# EAGLE board Baseboard (EAGLE 9.6.2)
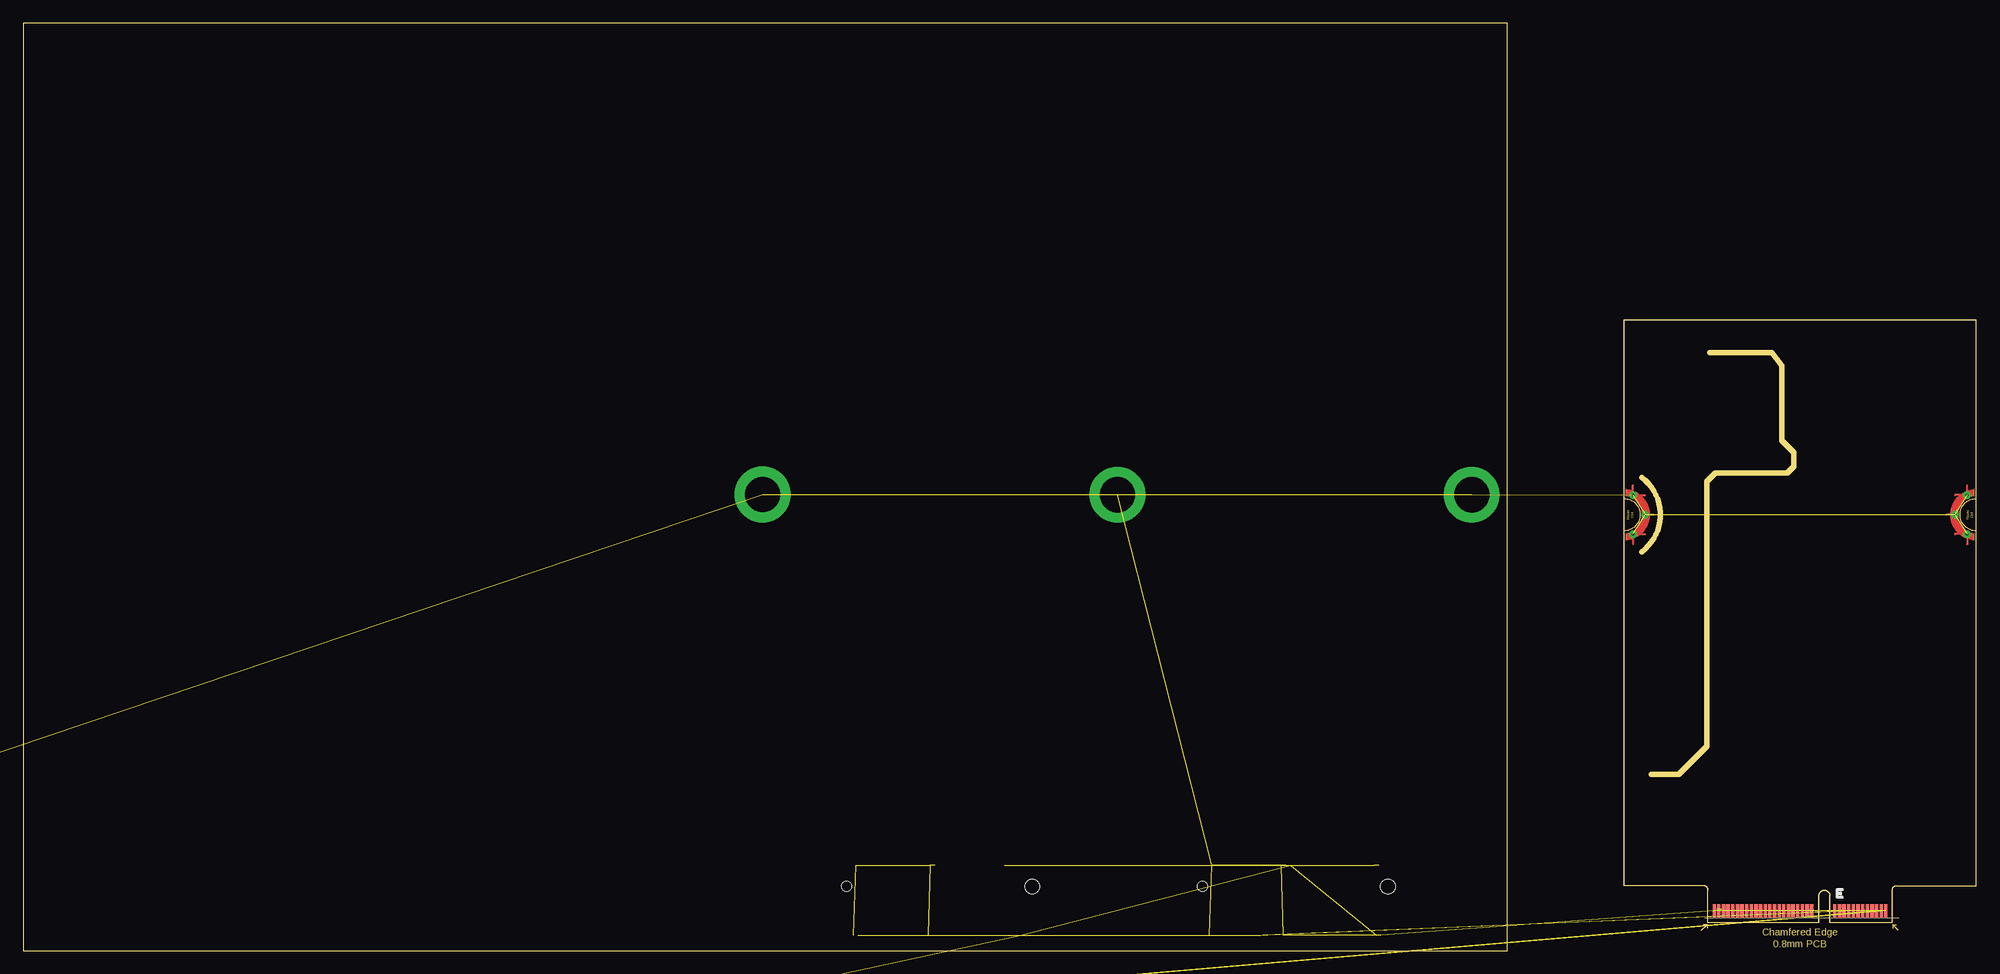
[diagram p15: board, top side]
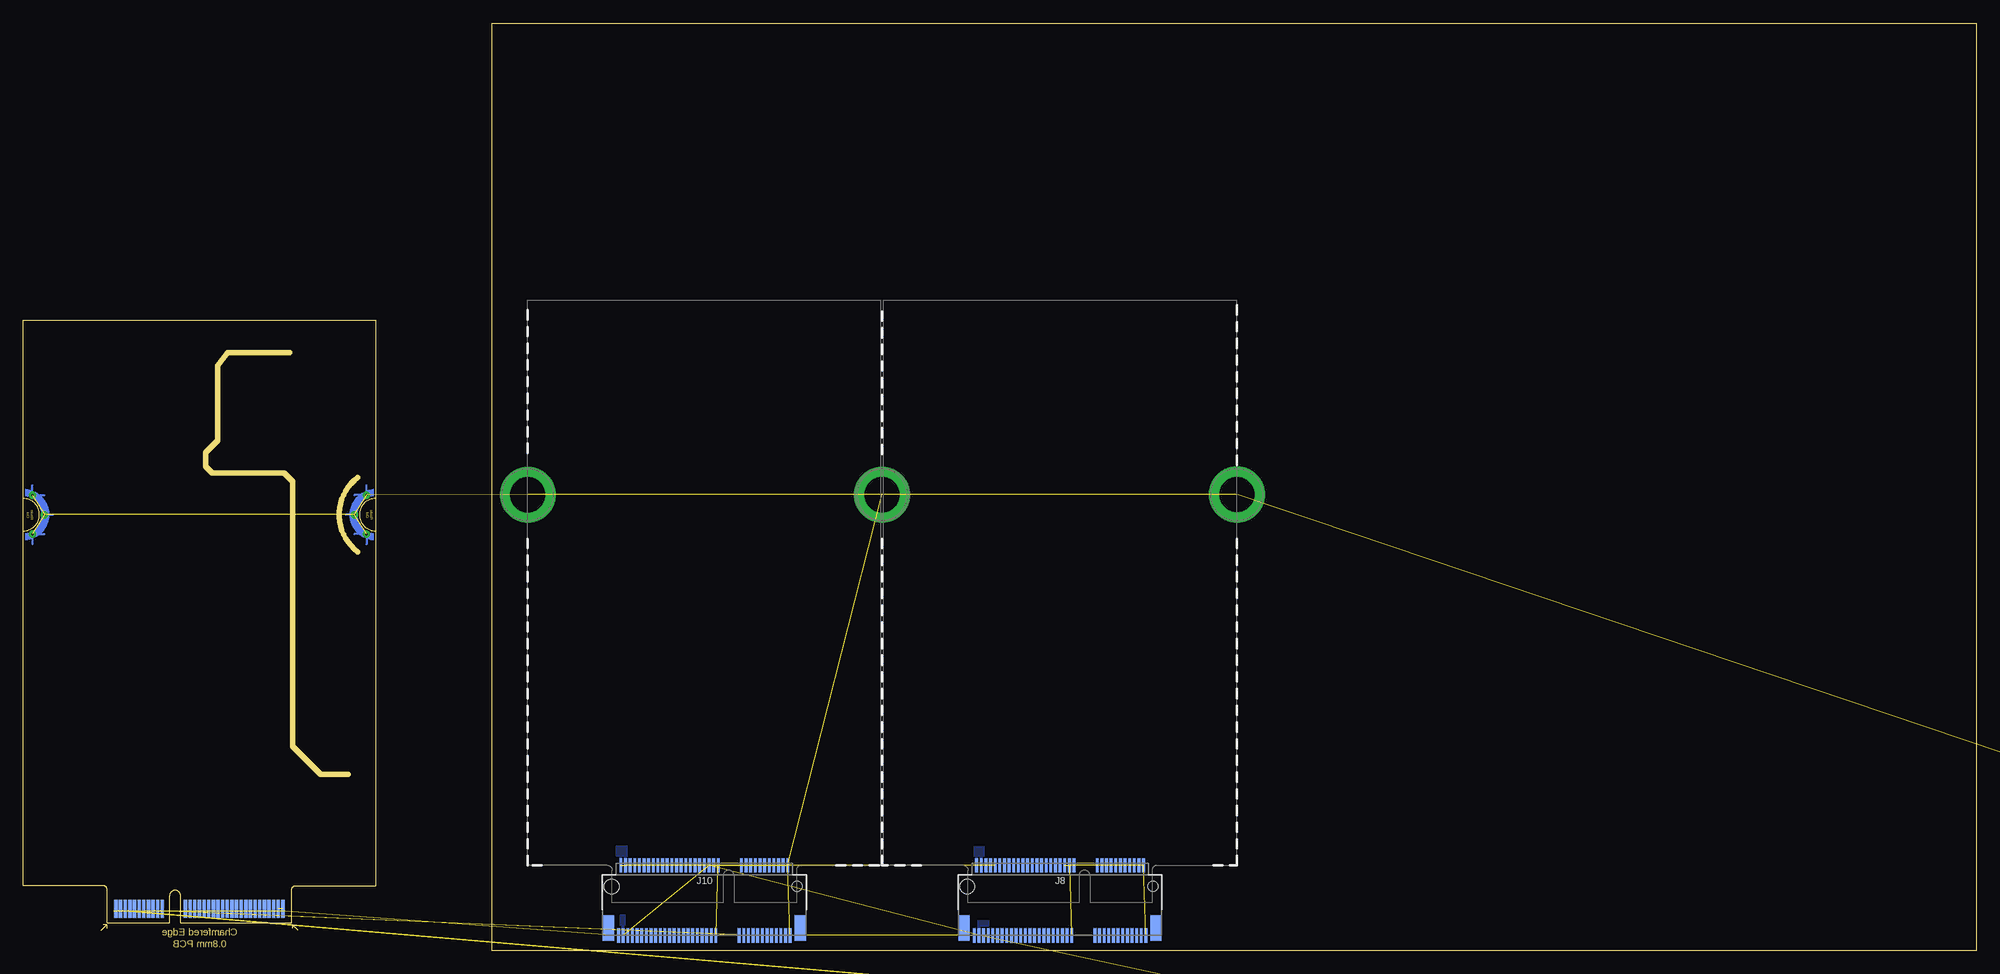
[diagram p16: board, bottom side, seen from below]

Size 210.55 x 100 mm. Coordinates in mm from the lower left corner, seen from the top.
Outline: 0,0 160,0 160,100 0,100 0,0
Outline: 201.47,3 194.78,3 194.78,5.9 arc180 193.57,5.9 193.57,3 181.62,3 181.62,6.5 arc90 181.15,7 172.55,7 172.55,68 210.55,68 210.55,7 201.95,7 arc90 201.47,6.5 201.47,3
Copper layers (1*16): Top 0.035mm / dielectric 1.5mm / Bottom 0.035mm
Design rules "default": minimum track width 6mil, minimum drill 0.35mm, track to track 6mil, track to pad 6mil, pad to pad 6mil, via to via 6mil, smd to smd 6mil, copper to edge 40mil, drill to drill 6mil, minimum pad ring 10mil, minimum via ring 8mil, stop-mask expansion 4mil, vias tented up to drill 0mil, thermal gap 10mil
Net classes: 0 default: width 0 mm, drill 0 mm; 1 POWER: width 0.559 mm, drill 0.305 mm; 2 Diff pairs: width 0.203 mm, drill 0.305 mm
bRestrict: area 135.8,9 to 135.9,9.4; area 135.3,9 to 135.4,9.4; area 98,9 to 98.1,9.4; area 97.4,9 to 97.6,9.4; area 65,25.9 to 65.1,26.1
Milling: 12 lines

## Footprints (pad centres in the part's own frame; a part is rotated, then mirrored left to right if it is on the bottom)
WJ212R-THR-3.5-2 = drill 1 square: 1A 5.6,10.6; 1B 5.6,3.6; 2A 2.1,10.6; 2B 2.1,3.6
DISCRETE_C0603 = smd 0.889 x 0.889: 1 -0.762,0; 2 0.762,0
PANASONIC_E = smd 3.8 x 1.4: + 3,0; - -3,0
DISCRETE_C1206 = smd 1.27 x 2.032: 1 -1.651,0; 2 1.651,0
0805-NO = smd 1.24 x 1.5: 1 -0.95,0; 2 0.95,0
C1206 = smd 1.27 x 2.032: 1 -1.651,0; 2 1.651,0
PANASONIC_D = smd 3 x 1.4: + 2.4,0; - -2.4,0
0603-CAP = smd 1.1 x 1: 1 -0.85,0; 2 0.85,0
C0603 = smd 1.1 x 1: 1 -0.85,0; 2 0.85,0
C1206' = smd 1.6 x 1.8: 1 -1.4,0; 2 1.4,0
0603 = smd 1.1 x 1: 1 -0.85,0; 2 0.85,0
1206 = smd 1.6 x 1.8: 1 -1.4,0; 2 1.4,0
C0402 = smd 0.7 x 0.9: 1 -0.65,0; 2 0.65,0
SOT363 = smd 0.5 x 0.5: 1 -0.75,-0.9; 3 0.75,-0.9; 4 0.75,0.9; 6 -0.75,0.9 | smd 0.4 x 0.5: 2 0,-0.9; 5 0,0.9
CHIP-LED0603 = smd 0.8 x 0.8: A 0,-0.75; C 0,0.75
DO-214AC = smd 1.8 x 2.4: A 2.025,0; C -2.025,0
SOD87 = smd 1.45 x 2.6: 1 -2.445,0; 2 2.445,0
SOT23 = smd 1 x 1.4: 1 -0.95,-1.1; 2 0.95,-1.1; 3 0,1.1
SMB = smd 2.4 x 2.4: A 2.2,0; C -2.2,0
SOT-23-6 = smd 0.55 x 1.35: 1 -0.95,-1.375; 2 0,-1.375; 3 0.95,-1.375; 4 0.95,1.375; 5 0,1.375; 6 -0.95,1.375
SOD123FL = smd 0.91 x 1.22: A 1.625,0; C -1.625,0
SOD-323 = smd 0.63 x 0.83: A 1.15,0; C -1.15,0
WJ212R-THR-3.5-3 = drill 1 square: 1A 9.1,10.6; 1B 9.1,3.6; 2A 5.6,10.6; 2B 5.6,3.6; 3A 2.1,10.6; 3B 2.1,3.6
1206L = smd 1 x 1.8: 1 -1.4,0; 2 1.4,0
STAND-OFF-REFLOW-M2.5 = drill 3.8 pad 6: 1 0,0
SO08 = smd 0.66 x 2.032: 1 -1.905,-3.073; 2 -0.635,-3.073; 3 0.635,-3.073; 4 1.905,-3.073; 5 1.905,3.073; 6 0.635,3.073; 7 -0.635,3.073; 8 -1.905,3.073
CH376S-SOIC = smd 2.052 x 0.602: A0 -4.654,-0.635; ACT# 4.654,3.175; BZ/D4 4.654,-3.175; D0 4.654,-8.255; D1 4.654,-6.985; D2 4.654,-5.715; GND -4.654,-5.715; INT# -4.654,8.255; NC -4.654,0.635; PCS# 4.654,6.985; RD# -4.654,4.445; RSTI -4.654,6.985; RXD -4.654,1.905; SCK/D5 4.654,-1.905; SCS/D3 4.654,-4.445; SD-CK 4.654,5.715; SD-CS 4.654,1.905; SD-DO 4.654,4.445; SDI/D6 4.654,-0.635; SDO/D7 4.654,0.635; TXD -4.654,3.175; UD+ -4.654,-3.175; UD- -4.654,-4.445; V3 -4.654,-1.905; VCC 4.654,8.255; WR# -4.654,5.715; XI -4.654,-6.985; XO -4.654,-8.255
TO263-5 = smd 1.067 x 2.159: 1 -3.404,-5.791; 2 -1.702,-5.791; 3 0,-5.791; 4 1.702,-5.791; 5 3.404,-5.791 | smd 10.8 x 10.41: 6 0,2.54
SOT223 = smd 1.5 x 2: 1 -2.3,-3.15; 2 0,-3.15; 3 2.3,-3.15 | smd 3.8 x 2: 4 0,3.15
SO16W = smd 0.6 x 2.2: 1 -4.445,-4.6; 2 -3.175,-4.6; 3 -1.905,-4.6; 4 -0.635,-4.6; 5 0.635,-4.6; 6 1.905,-4.6; 7 3.175,-4.6; 8 4.445,-4.6; 9 4.445,4.6; 10 3.175,4.6; 11 1.905,4.6; 12 0.635,4.6; 13 -0.635,4.6; 14 -1.905,4.6; 15 -3.175,4.6; 16 -4.445,4.6
SULLINS_SBH11-PBPC-D05-ST-BK = drill 1 square: 1 -5.08,-1.27 | drill 1: 2 -5.08,1.27; 3 -2.54,-1.27; 4 -2.54,1.27; 5 0,-1.27; 6 0,1.27; 7 2.54,-1.27; 8 2.54,1.27; 9 5.08,-1.27; 10 5.08,1.27
MAGJACK-SYM_LED = drill 0.9 pad 1.5: 1 -5.715,8.89; 2 -4.445,6.35; 3 -3.175,8.89; 4 -1.905,6.35; 5 -0.635,8.89; 6 0.635,6.35; 7 1.905,8.89; 8 3.175,6.35; 9 4.445,8.89; 10 5.715,6.35; 11 -6.63,-4.06; 12 -4.09,-4.06; 13 4.09,-4.06; 14 6.63,-4.06 | drill 1.7 pad 2.4: S1 -7.875,3.05; S2 7.875,3.05 | hole 3.25: -5.715,0; 5.715,0
SEEED_110990030 = drill 0.8 square: 1 -3,0 | drill 0.8: 2 -1,0; 3 1,0; 4 3,0
M.2-CONNECTOR-E-FUNCTION-STANDARD = smd 0.3 x 1.55: 1 9.25,-5.275; 2 9,2.275; 3 8.75,-5.275; 4 8.5,2.275; 5 8.25,-5.275; 6 8,2.275; 7 7.75,-5.275; 8 7.5,2.275; 9 7.25,-5.275; 10 7,2.275; 11 6.75,-5.275; 12 6.5,2.275; 13 6.25,-5.275; 14 6,2.275; 15 5.75,-5.275; 16 5.5,2.275; 17 5.25,-5.275; 18 5,2.275; 19 4.75,-5.275; 20 4.5,2.275; 21 4.25,-5.275; 22 4,2.275; 23 3.75,-5.275; 32 1.5,2.275; 33 1.25,-5.275; 34 1,2.275; 35 0.75,-5.275; 36 0.5,2.275; 37 0.25,-5.275; 38 0,2.275; 39 -0.25,-5.275; 40 -0.5,2.275; 41 -0.75,-5.275; 42 -1,2.275; 43 -1.25,-5.275; 44 -1.5,2.275; 45 -1.75,-5.275; 46 -2,2.275; 47 -2.25,-5.275; 48 -2.5,2.275; 49 -2.75,-5.275; 50 -3,2.275; 51 -3.25,-5.275; 52 -3.5,2.275; 53 -3.75,-5.275; 54 -4,2.275; 55 -4.25,-5.275; 56 -4.5,2.275; 57 -4.75,-5.275; 58 -5,2.275; 59 -5.25,-5.275; 60 -5.5,2.275; 61 -5.75,-5.275; 62 -6,2.275; 63 -6.25,-5.275; 64 -6.5,2.275; 65 -6.75,-5.275; 66 -7,2.275; 67 -7.25,-5.275; 68 -7.5,2.275; 69 -7.75,-5.275; 70 -8,2.275; 71 -8.25,-5.275; 72 -8.5,2.275; 73 -8.75,-5.275; 74 -9,2.275; 75 -9.25,-5.275 | smd 1.2 x 2.75: A1 10.35,-4.5; A2 -10.35,-4.5 | hole 1.1: 10,0 | hole 1.6: -10,0
1X2-3.5MM = drill 1 pad 2.184: 1 1.8,0; 2 -1.7,0
M.2-CARD-E-22_FUNCTION_STANDARD = smd 0.35 x 1.45: 1 9.25,1.275; 3 8.75,1.275; 5 8.25,1.275; 7 7.75,1.275; 9 7.25,1.275; 11 6.75,1.275; 13 6.25,1.275; 15 5.75,1.275; 17 5.25,1.275; 19 4.75,1.275; 21 4.25,1.275; 23 3.75,1.275; 33 1.25,1.275; 35 0.75,1.275; 37 0.25,1.275; 39 -0.25,1.275; 41 -0.75,1.275; 43 -1.25,1.275; 45 -1.75,1.275; 47 -2.25,1.275; 49 -2.75,1.275; 51 -3.25,1.275; 53 -3.75,1.275; 55 -4.25,1.275; 57 -4.75,1.275; 59 -5.25,1.275; 61 -5.75,1.275; 63 -6.25,1.275; 65 -6.75,1.275; 67 -7.25,1.275; 69 -7.75,1.275; 71 -8.25,1.275; 73 -8.75,1.275; 75 -9.25,1.275 | smd 0.35 x 1.95 bottom: 2 9,1.525; 4 8.5,1.525; 6 8,1.525; 8 7.5,1.525; 10 7,1.525; 12 6.5,1.525; 14 6,1.525; 16 5.5,1.525; 18 5,1.525; 20 4.5,1.525; 22 4,1.525; 32 1.5,1.525; 34 1,1.525; 36 0.5,1.525; 38 0,1.525; 40 -0.5,1.525; 42 -1,1.525; 44 -1.5,1.525; 46 -2,1.525; 48 -2.5,1.525; 50 -3,1.525; 52 -3.5,1.525; 54 -4,1.525; 56 -4.5,1.525; 58 -5,1.525; 60 -5.5,1.525; 62 -6,1.525; 64 -6.5,1.525; 66 -7,1.525; 68 -7.5,1.525; 70 -8,1.525; 72 -8.5,1.525; 74 -9,1.525 | drill 0.305 pad 0.61: GND1 -18,41.9; GND2 -16.7,44; GND3 -18,46.1; GND4 18,41.9; GND5 16.7,44; GND6 18,46.1
FB805 = smd 1.3 x 1.5: 1 -0.85,0; 2 0.85,0
DR127 = smd 3.85 x 5.5: 1 -4.975,0; 2 4.975,0
DP_DEVICES_SW_TACT_STANDARD_RIGHT_ANGLE = drill 1: 1 -2.25,0; 2 2.25,0 | drill 1.5: 3 -3.5,2.5; 4 3.5,2.5
WJ212R-THR-3.5-4 = drill 1 square: 1A 12.6,10.6; 1B 12.6,3.6; 2A 9.1,10.6; 2B 9.1,3.6; 3A 5.6,10.6; 3B 5.6,3.6; 4A 2.1,10.6; 4B 2.1,3.6
SOT-23 = smd 0.802 x 0.972: P1 -0.95,-0.917; P2 0.95,-0.917; P3 0,0.917
SOT23-BEC = smd 1 x 1.4: B -0.95,-1.1; C 0,1.1; E 0.95,-1.1
R0603 = smd 1 x 1.1: 1 -0.85,0; 2 0.85,0
0603@1 = smd 1.1 x 1: 1 -0.85,0; 2 0.85,0
DISCRETE_R0603 = smd 0.889 x 0.889: 1 -0.762,0; 2 0.762,0
R0603' = smd 0.889 x 0.889: 1 -0.762,0; 2 0.762,0
R2512 = smd 1.8 x 3.2: 1 -2.8,0; 2 2.8,0
R0204/5 = drill 0.813 octagon: 1 -2.54,0; 2 2.54,0
R0402 = smd 0.6 x 0.7: 1 -0.5,0; 2 0.5,0
CTS-219-06 = smd 1.13 x 2.44: 1 -6.35,-4.3; 2 -3.81,-4.3; 3 -1.27,-4.3; 4 1.27,-4.3; 5 3.81,-4.3; 6 6.35,-4.3; 7 6.35,4.3; 8 3.81,4.3; 9 1.27,4.3; 10 -1.27,4.3; 11 -3.81,4.3; 12 -6.35,4.3
9P-SMD-W/-RING = smd 1.524 x 0.762: 1 0,4.4; 2 0,3.3; 3 0,2.2; 4 0,1.1; 5 0,0; 6 0,-1.1; 7 0,-2.2; 8 0,-3.3; 9 0,-4.4 | smd 1.524 x 1.016: G1 0.6,-5.746 | smd 2.032 x 1.524: G2 10.373,-5.4; G3 10.373,10 | smd 1.524 x 1.524: G4 0.392,9.181 | hole 0.889: 10.9,-2.6; 10.9,5.4
SJ = smd 1.168 x 1.6: 1 -0.762,0; 2 0.762,0
QFN20_4MM_0.65MM = smd 0.35 x 0.95: 1 -1.3,-2.34; 2 -0.65,-2.34; 3 0,-2.34; 4 0.65,-2.34; 5 1.3,-2.34; 11 1.3,2.34; 12 0.65,2.34; 13 0,2.34; 14 -0.65,2.34; 15 -1.3,2.34 | smd 0.95 x 0.35: 6 2.34,-1.3; 7 2.34,-0.65; 8 2.34,0; 9 2.34,0.65; 10 2.34,1.3; 16 -2.34,1.3; 17 -2.34,0.65; 18 -2.34,0; 19 -2.34,-0.65; 20 -2.34,-1.3 | smd 3.25 x 3.25: PAD 0,0
LED_WS2812-2020 = smd 0.7 x 0.7: 1 0.915,-0.55; 2 0.915,0.55; 3 -0.915,0.55; 4 -0.915,-0.55
XCVR_ESP32S3WROOM1N8R8 = smd 1.5 x 0.9: 1 -8.75,5.26; 2 -8.75,3.99; 3 -8.75,2.72; 4 -8.75,1.45; 5 -8.75,0.18; 6 -8.75,-1.09; 7 -8.75,-2.36; 8 -8.75,-3.63; 9 -8.75,-4.9; 10 -8.75,-6.17; 11 -8.75,-7.44; 12 -8.75,-8.71; 13 -8.75,-9.98; 14 -8.75,-11.25; 27 8.75,-11.25; 28 8.75,-9.98; 29 8.75,-8.71; 30 8.75,-7.44; 31 8.75,-6.17; 32 8.75,-4.9; 33 8.75,-3.63; 34 8.75,-2.36; 35 8.75,-1.09; 36 8.75,0.18; 37 8.75,1.45; 38 8.75,2.72; 39 8.75,3.99; 40 8.75,5.26 | smd 0.9 x 1.5: 15 -6.985,-12.5; 16 -5.715,-12.5; 17 -4.445,-12.5; 18 -3.175,-12.5; 19 -1.905,-12.5; 20 -0.635,-12.5; 21 0.635,-12.5; 22 1.905,-12.5; 23 3.175,-12.5; 24 4.445,-12.5; 25 5.715,-12.5; 26 6.985,-12.5 | smd 0.9 x 0.9: 41_1 -1.5,-2.46; 41_2 -2.9,-2.46; 41_3 -0.1,-2.46; 41_4 -2.9,-3.86; 41_5 -1.5,-3.86; 41_6 -0.1,-3.86; 41_7 -2.9,-1.06; 41_8 -1.5,-1.06; 41_9 -0.1,-1.06
MSOP10 = smd 0.25 x 1: 1 -1,-2.113; 2 -0.5,-2.113; 3 0,-2.113; 4 0.5,-2.113; 5 1,-2.113; 6 1,2.113; 7 0.5,2.113; 8 0,2.113; 9 -0.5,2.113; 10 -1,2.113
LQFP-48 = smd 0.254 x 1.143: 1 -2.75,-4.25; 2 -2.25,-4.25; 3 -1.75,-4.25; 4 -1.25,-4.25; 5 -0.75,-4.25; 6 -0.25,-4.25; 7 0.25,-4.25; 8 0.75,-4.25; 9 1.25,-4.25; 10 1.75,-4.25; 11 2.25,-4.25; 12 2.75,-4.25; 25 2.75,4.25; 26 2.25,4.25; 27 1.75,4.25; 28 1.25,4.25; 29 0.75,4.25; 30 0.25,4.25; 31 -0.25,4.25; 32 -0.75,4.25; 33 -1.25,4.25; 34 -1.75,4.25; 35 -2.25,4.25; 36 -2.75,4.25 | smd 1.143 x 0.254: 13 4.25,-2.75; 14 4.25,-2.25; 15 4.25,-1.75; 16 4.25,-1.25; 17 4.25,-0.75; 18 4.25,-0.25; 19 4.25,0.25; 20 4.25,0.75; 21 4.25,1.25; 22 4.25,1.75; 23 4.25,2.25; 24 4.25,2.75; 37 -4.25,2.75; 38 -4.25,2.25; 39 -4.25,1.75; 40 -4.25,1.25; 41 -4.25,0.75; 42 -4.25,0.25; 43 -4.25,-0.25; 44 -4.25,-0.75; 45 -4.25,-1.25; 46 -4.25,-1.75; 47 -4.25,-2.25; 48 -4.25,-2.75
OPTO_EL357N-G = smd 1.676 x 0.813: 1 -3.175,1.27; 2 -3.175,-1.27; 3 3.175,-1.27; 4 3.175,1.27
JRC-21F-4100 = drill 1 offset: C1 -4.3,3.8; C2 -4.3,-3.8; COIL+ 5.85,-3.8; COIL- 5.85,3.8; NC 8.4,-3.8; NO 8.4,3.8
USB-C-16P = smd 0.3 x 1.45: A5 -1.25,0; A6 -0.25,0; A7 0.25,0; A8 1.25,0; B5 1.75,0; B6 0.75,0; B7 -0.75,0; B8 -1.75,0 | smd 0.6 x 1.45: GND -3.225,0; GND2 3.225,0 | smd 1 x 2.1: SHLD1 -4.32,-0.915; SHLD2 4.32,-0.915 | smd 1 x 2.1 bottom: SHLD3 -4.32,-0.915; SHLD4 4.32,-0.915 | smd 1 x 1.6: SHLD5 -4.32,-5.095; SHLD8 4.32,-5.095 | smd 1 x 1.6 bottom: SHLD6 -4.32,-5.095; SHLD7 4.32,-5.095 | smd 0.55 x 1.45: VBUS1 -2.45,0; VBUS2 2.45,0 | hole 0.65: -2.89,-1.445; 2.89,-1.445
USB-A-H = drill 0.914: D+ 2.718,-1.003; D- 2.718,1.003; GND 2.718,-3.493; VBUS 2.718,3.493 | drill 2.311: GND@1 0,6.566; GND@2 0,-6.566
B4B-XH = drill 1 square: P$1 3.75,0 | drill 1: P$2 1.25,0; P$3 -1.25,0; P$4 -3.75,0
CRYSTAL_3.2X2.5 = smd 1.4 x 1.2: 1 -1.1,-0.8; 2 1.1,0.8; GND1 -1.1,0.8; GND2 1.1,-0.8
CRYSTAL-SMD-2.0X1.6MM = smd 0.75 x 0.7: 1 -0.675,-0.5; 2 0.675,-0.5; 3 0.675,0.5; 4 -0.675,0.5

## Placement (x,y rotation side)
4-20-1  WJ212R-THR-3.5-2  [WJ212R-THR-3.5-2]  -252.5,-872.5 0 top  (outside the outline)
4-20-2  WJ212R-THR-3.5-2  [WJ212R-THR-3.5-2]  -243.5,-872.5 0 top  (outside the outline)
4-20-3  WJ212R-THR-3.5-2  [WJ212R-THR-3.5-2]  -234.5,-872.5 0 top  (outside the outline)
4-20-4  WJ212R-THR-3.5-2  [WJ212R-THR-3.5-2]  -252.5,-887 0 top  (outside the outline)
ADC1  WJ212R-THR-3.5-2  [WJ212R-THR-3.5-2]  -252.5,-827 0 top  (outside the outline)
ADC2  WJ212R-THR-3.5-2  [WJ212R-THR-3.5-2]  -243.5,-827 0 top  (outside the outline)
ADC3  WJ212R-THR-3.5-2  [WJ212R-THR-3.5-2]  -234.5,-827 0 top  (outside the outline)
ADC4  WJ212R-THR-3.5-2  [WJ212R-THR-3.5-2]  -225.5,-827 0 top  (outside the outline)
C1  0.01uF  [DISCRETE_C0603]  -239,-926 0 top  (outside the outline)
C2  0.1uF  [DISCRETE_C0603]  -243.5,-992.5 0 top  (outside the outline)
C3  220µF 50V  [PANASONIC_E]  -19.05,45.72 0 top  (outside the outline)
C4  10uF  [DISCRETE_C1206]  -250.5,-988.5 0 top  (outside the outline)
C5  220µF 50V  [PANASONIC_E]  -30.48,45.72 0 top  (outside the outline)
C6  0.1uF  [0805-NO]  -251.5,-966 0 top  (outside the outline)
C7  10uF  [C1206]  -250.5,-921 0 top  (outside the outline)
C8  0.1uF  [DISCRETE_C0603]  -30.48,77.47 0 top  (outside the outline)
C9  0.1uF  [0805-NO]  -246,-966 0 top  (outside the outline)
C10  100nF  [0805-NO]  -236,-955.5 0 top  (outside the outline)
C11  10uF  [C1206]  -245,-921 0 top  (outside the outline)
C12  10uF  [0805-NO]  -251.5,-963.5 0 top  (outside the outline)
C13  10uF  [C1206]  -250.5,-842 0 top  (outside the outline)
C14  0.1uF  [DISCRETE_C0603]  -34.29,77.47 0 top  (outside the outline)
C15  0.1uF  [DISCRETE_C0603]  -38.1,77.47 0 top  (outside the outline)
C16  10uF  [C1206]  -57.15,62.23 0 top  (outside the outline)
C17  100uF  [PANASONIC_D]  -71.12,53.34 0 top  (outside the outline)
C18  0.1uF  [0603-CAP]  -57.15,78.74 0 top  (outside the outline)
C19  10uF  [C1206]  -62.23,62.23 0 top  (outside the outline)
C20  0.1uF  [DISCRETE_C0603]  -41.91,77.47 0 top  (outside the outline)
C21  0.1uF  [DISCRETE_C0603]  -45.72,77.47 0 top  (outside the outline)
C22  10uF  [C1206]  -67.31,62.23 0 top  (outside the outline)
C23  1uF  [C1206]  -245,-842 0 top  (outside the outline)
C24  0.1uF  [0805-NO]  -234.5,-857 0 top  (outside the outline)
C25  10uF  [C1206]  -234.5,-899.5 0 top  (outside the outline)
C26  1uF  [C1206]  -229,-899.5 0 top  (outside the outline)
C27  0.1uF  [0805-NO]  -231.5,-904 0 top  (outside the outline)
C28  22P  [C0603]  -227,-1026.5 0 top  (outside the outline)
C29  22P  [C0603]  -252,-1031.5 0 top  (outside the outline)
C30  0.1uF  [C0603]  -245,-1026.5 0 top  (outside the outline)
C31  0.1uF  [C0603]  -239,-1026.5 0 top  (outside the outline)
C32  10uF  [C1206']  -251,-1020.5 0 top  (outside the outline)
C33  0.47uF  [C0603]  -252,-1026.5 0 top  (outside the outline)
C34  0.1uF  [C0603]  -233,-1026.5 0 top  (outside the outline)
C35  10uF  [C1206']  -245,-1020.5 0 top  (outside the outline)
C36  220µF 50V  [PANASONIC_E]  -233.5,-774.5 0 top  (outside the outline)
C37  220µF 50V  [PANASONIC_E]  -248,-788 0 top  (outside the outline)
C38  0.1uF  [0603]  -167.5,-25.5 180 top  (outside the outline)
C39  10pF  [0603]  -178,-22.5 270 top  (outside the outline)
C40  10pF  [0603]  -171,-22.5 90 top  (outside the outline)
C41  10uF  [0603]  -167.5,-22.5 180 top  (outside the outline)
C42  0.1uF  [0603]  -178.5,-15.5 270 top  (outside the outline)
C43  0.1uF  [0603]  -176.5,-15.5 270 top  (outside the outline)
C44  0.1uF  [0603]  -174.5,-15.5 270 top  (outside the outline)
C45  0.1uF  [0603]  -171.5,-41 270 top  (outside the outline)
C46  0.1uF  [0603]  -164.5,-37 0 top  (outside the outline)
C47  0.1uF  [0603]  -169.5,-41 270 top  (outside the outline)
C48  10uF  [0603]  -168.5,-15.5 270 top  (outside the outline)
C49  10nF  [0603]  -164.5,-31 0 top  (outside the outline)
C50  4.7uF  [0603]  -164.5,-33 0 top  (outside the outline)
C51  1nF  [1206]  -171.5,-58 0 top  (outside the outline)
C52  10nF  [0603]  -170.5,-48 90 top  (outside the outline)
C53  6.8nF  [0603]  -173.5,-48 270 top  (outside the outline)
C54  6.8nF  [0603]  -169,-48 270 top  (outside the outline)
C55  22nF  [0603]  -181,-48 90 top  (outside the outline)
C107_N0  100nF  [C0402]  -242,180 0 top  (outside the outline)
C107_N1  100nF  [C0402]  -233,180 0 top  (outside the outline)
C107_N2  100nF  [C0402]  -252,188.5 0 top  (outside the outline)
C107_N3  100nF  [C0402]  -243,188.5 0 top  (outside the outline)
C107_N4  100nF  [C0402]  -242,284.5 0 top  (outside the outline)
C107_N5  100nF  [C0402]  -233,284.5 0 top  (outside the outline)
C107_N6  100nF  [C0402]  -252,293 0 top  (outside the outline)
C107_N7  100nF  [C0402]  -243,293 0 top  (outside the outline)
D1  SMF05C  [SOT363]  -240,-991.5 0 top  (outside the outline)
D2_I1  GRN  [CHIP-LED0603]  -251,446.5 0 top  (outside the outline)
D2_I2  GRN  [CHIP-LED0603]  -251,459 0 top  (outside the outline)
D2_I3  GRN  [CHIP-LED0603]  -251,470.5 0 top  (outside the outline)
D2_I4  GRN  [CHIP-LED0603]  -251,482 0 top  (outside the outline)
D2_I5  GRN  [CHIP-LED0603]  -251,493.5 0 top  (outside the outline)
D2_I6  GRN  [CHIP-LED0603]  -251,505 0 top  (outside the outline)
D2_I7  GRN  [CHIP-LED0603]  -251,516.5 0 top  (outside the outline)
D2_I8  GRN  [CHIP-LED0603]  -251,528 0 top  (outside the outline)
D2_M1  GRN  [CHIP-LED0603]  -251,379.5 0 top  (outside the outline)
D2_M2  GRN  [CHIP-LED0603]  -251,337.5 0 top  (outside the outline)
D2_M3  GRN  [CHIP-LED0603]  -251,351.5 0 top  (outside the outline)
D2_M4  GRN  [CHIP-LED0603]  -251,365.5 0 top  (outside the outline)
D2_M5  GRN  [CHIP-LED0603]  -241,408 0 top  (outside the outline)
D2_M6  GRN  [CHIP-LED0603]  -215,393.5 0 top  (outside the outline)
D2_M7  GRN  [CHIP-LED0603]  -251,408 0 top  (outside the outline)
D2_M8  GRN  [CHIP-LED0603]  -246,408 0 top  (outside the outline)
D5  M4  [DO-214AC]  -16.51,54.61 0 top  (outside the outline)
D6  SS34  [SOD87]  -111.5,-264 0 top  (outside the outline)
D7  M4  [DO-214AC]  -22.86,54.61 0 top  (outside the outline)
D8  BAT54S  [SOT23]  -236,-878.5 0 top  (outside the outline)
D9  BAT54S  [SOT23]  -228,-878.5 0 top  (outside the outline)
D10  BAT54S  [SOT23]  -251,-893 0 top  (outside the outline)
D11  BAT54S  [SOT23]  -243,-893 0 top  (outside the outline)
D12  5.1V  [SMB]  -59.69,45.72 0 top  (outside the outline)
D13  SS34  [DO-214AC]  -35.56,54.61 0 top  (outside the outline)
D14  SS34  [DO-214AC]  -41.91,54.61 0 top  (outside the outline)
D15  BAT54S  [SOT23]  -245,-833 0 top  (outside the outline)
D17  BAT54S  [SOT23]  -237,-833 0 top  (outside the outline)
D18  BAT54S  [SOT23]  -229,-833 0 top  (outside the outline)
D19  BAT54S  [SOT23]  -221,-833 0 top  (outside the outline)
D20  SS34  [DO-214AC]  -224.5,-787.5 0 top  (outside the outline)
D21  12.2V  [SMB]  -238.5,-788 0 top  (outside the outline)
D22  SS34  [SOD87]  -231.5,-787.5 0 top  (outside the outline)
D23  M4  [DO-214AC]  -249.5,-796 0 top  (outside the outline)
D24  M4  [DO-214AC]  -243,-796 0 top  (outside the outline)
D25  DT1042-04SO  [SOT-23-6]  -176.5,-58 270 top  (outside the outline)
D30_RL1  B5819W  [SOD123FL]  -240,426.5 0 top  (outside the outline)
D30_RL2  B5819W  [SOD123FL]  -251,-1067 0 top  (outside the outline)
D30_RL3  B5819W  [SOD123FL]  -251,-1072.5 0 top  (outside the outline)
D30_RL4  B5819W  [SOD123FL]  -251,-1078 0 top  (outside the outline)
D30_RL5  B5819W  [SOD123FL]  -251,-1083.5 0 top  (outside the outline)
D30_RL6  B5819W  [SOD123FL]  -233,426.5 0 top  (outside the outline)
D30_RL7  B5819W  [SOD123FL]  -226,426.5 0 top  (outside the outline)
D30_RL8  B5819W  [SOD123FL]  -219,426.5 0 top  (outside the outline)
D39  SS34  [SOD87]  -67.31,45.72 0 top  (outside the outline)
D51  1N4148  [SOD-323]  -236,228.5 0 top  (outside the outline)
DS18B20  WJ212R-THR-3.5-3  [WJ212R-THR-3.5-3]  -252.5,203 0 top  (outside the outline)
F1_RL1  24V 460mA  [1206L]  -251,141 0 top  (outside the outline)
F1_RL2  24V 460mA  [1206L]  -240.5,141 0 top  (outside the outline)
F1_RL3  24V 460mA  [1206L]  -230,141 0 top  (outside the outline)
F1_RL4  24V 460mA  [1206L]  -219.5,141 0 top  (outside the outline)
F1_RL5  24V 460mA  [1206L]  -242.5,419 0 top  (outside the outline)
F1_RL6  24V 460mA  [1206L]  -232,419 0 top  (outside the outline)
F1_RL7  24V 460mA  [1206L]  -221.5,419 0 top  (outside the outline)
F1_RL8  24V 460mA  [1206L]  -251,426.5 0 top  (outside the outline)
FB1  [0805-NO]  -240.5,-966 0 top  (outside the outline)
FB2  470Ω  [0603]  -180.5,-15.5 270 top  (outside the outline)
FRAME12  FRAME-LEDGERNO_FOOTPRINT  [DUMMY]  124.17,-27.63 0 bottom  (outside the outline)
H2  STAND-OFF-REFLOW-M2.5_2.5MM_TALL  [STAND-OFF-REFLOW-M2.5]  117.96,49.15 180 bottom
H3  STAND-OFF-REFLOW-M2.5_2.5MM_TALL  [STAND-OFF-REFLOW-M2.5]  156.16,49.15 90 bottom
H4  STAND-OFF-REFLOW-M2.5_2.5MM_TALL  [STAND-OFF-REFLOW-M2.5]  79.71,49.18 90 bottom
IC1  MAX31855  [SO08]  -248.5,-914 0 top  (outside the outline)
IC2  CH376  [CH376S-SOIC]  -247.5,-1006 0 top  (outside the outline)
IC3  LM2596HV-12  [TO263-5]  -245.5,-763 0 top  (outside the outline)
IC4  LM2596HV-5  [TO263-5]  -66.04,7.62 0 top  (outside the outline)
IC5  AP2114H-3.3TRG1  [SOT223]  -74.93,31.75 0 top  (outside the outline)
IC6  PCF8574T  [SO16W]  -246,238.5 0 top  (outside the outline)
IC7  PCF8574T  [SO16W]  -246,311.5 0 top  (outside the outline)
INPUT1  WJ212R-THR-3.5-2  [WJ212R-THR-3.5-2]  -252.5,156.5 0 top  (outside the outline)
INPUT2  WJ212R-THR-3.5-2  [WJ212R-THR-3.5-2]  -243.5,156.5 0 top  (outside the outline)
INPUT3  WJ212R-THR-3.5-2  [WJ212R-THR-3.5-2]  -234.5,156.5 0 top  (outside the outline)
INPUT4  WJ212R-THR-3.5-2  [WJ212R-THR-3.5-2]  -225.5,156.5 0 top  (outside the outline)
INPUT5  WJ212R-THR-3.5-2  [WJ212R-THR-3.5-2]  -252.5,261 0 top  (outside the outline)
INPUT6  WJ212R-THR-3.5-2  [WJ212R-THR-3.5-2]  -243.5,261 0 top  (outside the outline)
INPUT7  WJ212R-THR-3.5-2  [WJ212R-THR-3.5-2]  -234.5,261 0 top  (outside the outline)
INPUT8  WJ212R-THR-3.5-2  [WJ212R-THR-3.5-2]  -225.5,261 0 top  (outside the outline)
J1  SBH11-PBPC-D05-ST-BK  [SULLINS_SBH11-PBPC-D05-ST-BK]  -102.5,-149.5 0 top  (outside the outline)
J2  MAGJACK-POE  [MAGJACK-SYM_LED]  -174.5,-71 0 top  (outside the outline)
J3  SBH11-PBPC-D05-ST-BK  [SULLINS_SBH11-PBPC-D05-ST-BK]  -102.5,-180.5 0 top  (outside the outline)
J4  SBH11-PBPC-D05-ST-BK  [SULLINS_SBH11-PBPC-D05-ST-BK]  -102.5,-196 0 top  (outside the outline)
J5  SBH11-PBPC-D05-ST-BK  [SULLINS_SBH11-PBPC-D05-ST-BK]  -102.5,-211.5 0 top  (outside the outline)
J6  SBH11-PBPC-D05-ST-BK  [SULLINS_SBH11-PBPC-D05-ST-BK]  -102.5,-227 0 top  (outside the outline)
J7  110990030  [SEEED_110990030]  -109,-249 0 top  (outside the outline)
J8  MICROMOD_FUNCTION_MAIN  [M.2-CONNECTOR-E-FUNCTION-STANDARD]  98.77,6.91 0 bottom
J9  1X2-3.5MM  [1X2-3.5MM]  -240.5,-912 0 top  (outside the outline)
J10  MICROMOD_FUNCTION_MAIN  [M.2-CONNECTOR-E-FUNCTION-STANDARD]  137.12,6.91 0 bottom
J11  MICROMOD_STANDARD  [M.2-CARD-E-22_FUNCTION_STANDARD]  191.55,3 0 top
L1  [FB805]  -239.5,-921.5 0 top  (outside the outline)
L2  [FB805]  -250.5,-927 0 top  (outside the outline)
L3  33uH  [DR127]  -246,-777 0 top  (outside the outline)
L5  33uH  [DR127]  -20.32,34.29 0 top  (outside the outline)
MODE  RIGHTANGLETACTILE  [DP_DEVICES_SW_TACT_STANDARD_RIGHT_ANGLE]  -40.64,45.72 0 top  (outside the outline)
MOSFET1  WJ212R-THR-3.5-2  [WJ212R-THR-3.5-2]  -252.5,102 0 top  (outside the outline)
MOSFET2  WJ212R-THR-3.5-2  [WJ212R-THR-3.5-2]  -243.5,102 0 top  (outside the outline)
MOSFET3  WJ212R-THR-3.5-2  [WJ212R-THR-3.5-2]  -234.5,102 0 top  (outside the outline)
MOSFET4  WJ212R-THR-3.5-2  [WJ212R-THR-3.5-2]  -225.5,102 0 top  (outside the outline)
MOSFET5  WJ212R-THR-3.5-2  [WJ212R-THR-3.5-2]  -252.5,394 0 top  (outside the outline)
MOSFET6  WJ212R-THR-3.5-2  [WJ212R-THR-3.5-2]  -243.5,394 0 top  (outside the outline)
MOSFET7  WJ212R-THR-3.5-2  [WJ212R-THR-3.5-2]  -234.5,394 0 top  (outside the outline)
MOSFET8  WJ212R-THR-3.5-2  [WJ212R-THR-3.5-2]  -225.5,394 0 top  (outside the outline)
POWERIN  WJ212R-THR-3.5-2  [WJ212R-THR-3.5-2]  -113.03,-104.14 0 top  (outside the outline)
PT1  WJ212R-THR-3.5-4  [WJ212R-THR-3.5-4]  -252.5,-812.5 0 top  (outside the outline)
PT100  WJ212R-THR-3.5-4  [WJ212R-THR-3.5-4]  -252.5,-940.5 0 top  (outside the outline)
Q2_RL1  ST3422A  [SOT-23]  -236,410.5 0 top  (outside the outline)
Q2_RL2  ST3422A  [SOT-23]  -251,-1038 0 top  (outside the outline)
Q2_RL3  ST3422A  [SOT-23]  -251,-1045.5 0 top  (outside the outline)
Q2_RL4  ST3422A  [SOT-23]  -251,-1053 0 top  (outside the outline)
Q2_RL5  ST3422A  [SOT-23]  -251,-1060.5 0 top  (outside the outline)
Q2_RL6  ST3422A  [SOT-23]  -227,410.5 0 top  (outside the outline)
Q2_RL7  ST3422A  [SOT-23]  -218,410.5 0 top  (outside the outline)
Q2_RL8  ST3422A  [SOT-23]  -251,419.5 0 top  (outside the outline)
Q34  BC849SMD  [SOT23-BEC]  -235,219.5 0 top  (outside the outline)
R1  1K  [R0603]  -246,152 0 top  (outside the outline)
R2  100K  [R0603]  -252,147 0 top  (outside the outline)
R3  1K  [R0603]  -241,152 0 top  (outside the outline)
R4  100K  [R0603]  -246,147 0 top  (outside the outline)
R5  5.1k  [0603@1]  -73.66,73.66 0 top  (outside the outline)
R6  1K  [R0603]  -236,152 0 top  (outside the outline)
R7  5.1k  [0603@1]  -15.24,78.74 0 top  (outside the outline)
R8  100K  [R0603]  -240,147 0 top  (outside the outline)
R9  10K  [DISCRETE_R0603]  -245.5,-988 0 top  (outside the outline)
R10  430Ω / 4300Ω 0.1%  [0805-NO]  -245.5,-955.5 0 top  (outside the outline)
R11  10K  [0805-NO]  -232,-963.5 0 top  (outside the outline)
R12  10K  [0805-NO]  -245,-963.5 0 top  (outside the outline)
R13  10K  [0805-NO]  -238.5,-963.5 0 top  (outside the outline)
R14  10K  [R0603']  -246.5,-925.5 0 top  (outside the outline)
R15  10K  [R0603']  -242.5,-925.5 0 top  (outside the outline)
R16  10K  [R0603']  -41.91,73.66 0 top  (outside the outline)
R17  1M  [0603]  -174.5,-25.5 0 top  (outside the outline)
R18  1k  [0603]  -181.5,-58.5 90 top  (outside the outline)
R19  10K  [R0603']  -242,-857.5 0 top  (outside the outline)
R20  10K  [R0603']  -238,-857.5 0 top  (outside the outline)
R21  1K  [R0603]  -234,193.5 0 top  (outside the outline)
R22  10K  [R0603']  -45.72,73.66 0 top  (outside the outline)
R23  1K  [R0603]  -229,193.5 0 top  (outside the outline)
R24  10K  [R0603']  -224,-898.5 0 top  (outside the outline)
R25  10K  [DISCRETE_R0603]  -241.5,-988 0 top  (outside the outline)
R26  10K  [R0603']  -251,-904.5 0 top  (outside the outline)
R27  [R2512]  -233.5,-893 0 top  (outside the outline)
R28  10K  [DISCRETE_R0603]  -237.5,-988 0 top  (outside the outline)
R29  [R2512]  -225.5,-893 0 top  (outside the outline)
R30  [R2512]  -249.5,-900.5 0 top  (outside the outline)
R31  [R2512]  -241.5,-900.5 0 top  (outside the outline)
R32  1K  [R0603']  -247,-904.5 0 top  (outside the outline)
R33  10K  [DISCRETE_R0603]  -251,-992 0 top  (outside the outline)
R34  10K  [DISCRETE_R0603]  -247,-992 0 top  (outside the outline)
R35  1K  [R0603']  -243,-904.5 0 top  (outside the outline)
R36  1K  [R0603']  -239,-904.5 0 top  (outside the outline)
R37  1K  [R0603']  -235,-904.5 0 top  (outside the outline)
R38  10K  [R0204/5]  -239,-842 0 top  (outside the outline)
R39  10K  [R0204/5]  -232,-842 0 top  (outside the outline)
R40  10K  [R0204/5]  -225,-842 0 top  (outside the outline)
R41  10K  [R0204/5]  -250,-847.5 0 top  (outside the outline)
R42  10K  [R0204/5]  -243,-847.5 0 top  (outside the outline)
R43  10K  [R0204/5]  -236,-847.5 0 top  (outside the outline)
R44  10K  [R0204/5]  -229,-847.5 0 top  (outside the outline)
R45  10K  [R0204/5]  -222,-847.5 0 top  (outside the outline)
R46  100K  [R0603]  -240,-1020 0 top  (outside the outline)
R47  10K  [R0603]  -234,147 0 top  (outside the outline)
R48  10K  [R0603]  -228,147 0 top  (outside the outline)
R49  10K  [R0603]  -222,147 0 top  (outside the outline)
R50  10K  [R0603]  -216,147 0 top  (outside the outline)
R51  1K  [R0204/5]  -250,-853 0 top  (outside the outline)
R52  1K  [R0204/5]  -243,-853 0 top  (outside the outline)
R53  1K  [R0204/5]  -236,-853 0 top  (outside the outline)
R54  1K  [R0204/5]  -229,-853 0 top  (outside the outline)
R55  1K  [R0603]  -224,193.5 0 top  (outside the outline)
R56  1K  [R0603]  -252,198.5 0 top  (outside the outline)
R57  4K7  [R0603]  -241,229.5 0 top  (outside the outline)
R58  1k  [0603]  -167.5,-58.5 90 top  (outside the outline)
R59  12.4k  [0603]  -164.5,-35 180 top  (outside the outline)
R60  10k  [0603]  -181.5,-30 180 top  (outside the outline)
R61  100K  [R0603]  -234.5,-1020 0 top  (outside the outline)
R62  1K  [R0603]  -231,152 0 top  (outside the outline)
R63  100K  [R0603]  -252,152 0 top  (outside the outline)
R64  10k  [0603]  -181.5,-32 180 top  (outside the outline)
R65  10k  [0603]  -181.5,-34 180 top  (outside the outline)
R66  49.9  [0603]  -172,-48 90 top  (outside the outline)
R67  33  [0603]  -176.5,-41 270 top  (outside the outline)
R68  33  [0603]  -178,-41 270 top  (outside the outline)
R69  33  [0603]  -173.5,-41 270 top  (outside the outline)
R70  33  [0603]  -175,-41 270 top  (outside the outline)
R71  49.9  [0603]  -175,-48 90 top  (outside the outline)
R72  49.9  [0603]  -176.5,-48 270 top  (outside the outline)
R73  49.9  [0603]  -178,-48 270 top  (outside the outline)
R74  10  [0603]  -179.5,-48 90 top  (outside the outline)
R75  10k  [0603]  -164.5,-29 180 top  (outside the outline)
R76  10K  [R0603]  -246,247 0 top  (outside the outline)
R77  10K  [R0603]  -241,247 0 top  (outside the outline)
R78  1K  [R0603]  -234,298 0 top  (outside the outline)
R79  1K  [R0603]  -229,298 0 top  (outside the outline)
R80  1K  [R0603]  -224,298 0 top  (outside the outline)
R81  1K  [R0603]  -252,303 0 top  (outside the outline)
R82  10K  [R0603]  -252,320 0 top  (outside the outline)
R83  10K  [R0603]  -247,320 0 top  (outside the outline)
R84  1K  [R0603]  -252,389.5 0 top  (outside the outline)
R85  1K  [R0603]  -252,347.5 0 top  (outside the outline)
R86  1K  [R0603]  -252,361.5 0 top  (outside the outline)
R87  1K  [R0603]  -252,375.5 0 top  (outside the outline)
R88  1K  [R0603]  -222,437.5 0 top  (outside the outline)
R89  100K  [R0603]  -228,432.5 0 top  (outside the outline)
R90  1K  [R0603]  -217,437.5 0 top  (outside the outline)
R91  100K  [R0603]  -222,432.5 0 top  (outside the outline)
R92  1K  [R0603]  -252,442.5 0 top  (outside the outline)
R93  100K  [R0603]  -216,432.5 0 top  (outside the outline)
R94  1K  [R0603]  -247,442.5 0 top  (outside the outline)
R95  100K  [R0603]  -252,437.5 0 top  (outside the outline)
R96  10K  [R0603]  -246,437.5 0 top  (outside the outline)
R97  10K  [R0603]  -240,437.5 0 top  (outside the outline)
R98  10K  [R0603]  -234,437.5 0 top  (outside the outline)
R99  10K  [R0603]  -228,437.5 0 top  (outside the outline)
R100  1K  [R0603]  -252,432.5 0 top  (outside the outline)
R101  1K  [R0603]  -246,432.5 0 top  (outside the outline)
R102  1K  [R0603]  -240,432.5 0 top  (outside the outline)
R103  1K  [R0603]  -234,432.5 0 top  (outside the outline)
R104  1K  [R0603]  -252,455 0 top  (outside the outline)
R105  1K  [R0603]  -252,466.5 0 top  (outside the outline)
R106  1K  [R0603]  -252,478 0 top  (outside the outline)
R107  1K  [R0603]  -252,489.5 0 top  (outside the outline)
R108  1K  [R0603]  -252,501 0 top  (outside the outline)
R109  1K  [R0603]  -252,512.5 0 top  (outside the outline)
R110  1K  [R0603]  -252,524 0 top  (outside the outline)
R111  1K  [R0603]  -252,535.5 0 top  (outside the outline)
R124_N0  510R  [R0402]  -234,188.5 0 top  (outside the outline)
R124_N1  510R  [R0402]  -225,188.5 0 top  (outside the outline)
R124_N2  510R  [R0402]  -252,193.5 0 top  (outside the outline)
R124_N3  510R  [R0402]  -243,193.5 0 top  (outside the outline)
R124_N4  510R  [R0402]  -234,293 0 top  (outside the outline)
R124_N5  510R  [R0402]  -225,293 0 top  (outside the outline)
R124_N6  510R  [R0402]  -252,298 0 top  (outside the outline)
R124_N7  510R  [R0402]  -243,298 0 top  (outside the outline)
R154  1K  [R0603]  -252,229.5 0 top  (outside the outline)
R155  100K  [R0603]  -246.5,229.5 0 top  (outside the outline)
RELAY  WJ212R-THR-3.5-3  [WJ212R-THR-3.5-3]  -240,203 0 top  (outside the outline)
RESET  RIGHTANGLETACTILE  [DP_DEVICES_SW_TACT_STANDARD_RIGHT_ANGLE]  -50.8,45.72 0 top  (outside the outline)
S1  219-06  [CTS-219-06]  -242.5,-948.5 0 top  (outside the outline)
SD1  [9P-SMD-W/-RING]  -252.5,-979.5 0 top  (outside the outline)
SJ1  [SJ]  -223.5,-853.5 0 top  (outside the outline)
SJ2  [SJ]  -219,-853.5 0 top  (outside the outline)
SJ3  [SJ]  -251,-859 0 top  (outside the outline)
SJ4  [SJ]  -246.5,-859 0 top  (outside the outline)
SJ5  [SJ]  -246.5,256 0 top  (outside the outline)
SJ6  [SJ]  -242,256 0 top  (outside the outline)
SJ7  [SJ]  -237.5,256 0 top  (outside the outline)
SJ8  [SJ]  -251,324 0 top  (outside the outline)
SJ9  [SJ]  -246.5,324 0 top  (outside the outline)
SJ10  [SJ]  -241.5,318.5 0 top  (outside the outline)
U1  MAX31865  [QFN20_4MM_0.65MM]  -250.5,-958.5 0 top  (outside the outline)
U2  WS2812-2020  [LED_WS2812-2020]  -113,-257.5 0 top  (outside the outline)
U3  ESP32S3WROOM1N8R8  [XCVR_ESP32S3WROOM1N8R8]  -30.48,13.97 0 top  (outside the outline)
U4  ADS1115IDGST  [MSOP10]  -250.5,-836.5 0 top  (outside the outline)
U5  ADS1115IDGST  [MSOP10]  -241.5,-882 0 top  (outside the outline)
U6  W5500  [LQFP-48]  -173,-32 0 top  (outside the outline)
U34_N0  EL357N-G  [OPTO_EL357N-G]  -248.5,173 0 top  (outside the outline)
U34_N1  EL357N-G  [OPTO_EL357N-G]  -238.5,173 0 top  (outside the outline)
U34_N2  EL357N-G  [OPTO_EL357N-G]  -228.5,173 0 top  (outside the outline)
U34_N3  EL357N-G  [OPTO_EL357N-G]  -248.5,181.5 0 top  (outside the outline)
U34_N4  EL357N-G  [OPTO_EL357N-G]  -248.5,277.5 0 top  (outside the outline)
U34_N5  EL357N-G  [OPTO_EL357N-G]  -238.5,277.5 0 top  (outside the outline)
U34_N6  EL357N-G  [OPTO_EL357N-G]  -228.5,277.5 0 top  (outside the outline)
U34_N7  EL357N-G  [OPTO_EL357N-G]  -248.5,286 0 top  (outside the outline)
U$12  JRC-21F-4100  [JRC-21F-4100]  -247.5,221 0 top  (outside the outline)
USB  USB-C-Socket  [USB-C-16P]  -55.88,35.56 0 top  (outside the outline)
USB1  USB-A-H  [USB-A-H]  -231,-1003 0 top  (outside the outline)
X1  04-JST-B4B-XH-A  [B4B-XH]  -107.5,-240 0 top  (outside the outline)
XTAL2  12MHz  [CRYSTAL_3.2X2.5]  -228,-1020 0 top  (outside the outline)
Y1  25MHz  [CRYSTAL-SMD-2.0X1.6MM]  -174,-22.5 270 top  (outside the outline)

## Tracks (layer width: path | path; a pad name or v marks a point on that pad's centre or on a via)
3.3V  (11 unrouted)
  pour Bottom (no thermals): 107.35,2.64 107.33,2.65 106.44,2.65 106.44,3.21 107.66,3.21 107.66,1.1 107.38,1.1 107.38,2.6 107.37,2.62
  pour Bottom (no thermals): 146.02,2.77 146.01,2.75 146.01,1.35 145.76,1.35 145.76,2.75 145.75,2.77 145.73,2.79 145.71,2.8 145.63,2.8 145.63,3.79 146.19,3.79 146.19,2.8 146.06,2.8 146.04,2.79
4-20-0  (2 unrouted)
4-20-1  (2 unrouted)
4-20-3  (2 unrouted)
4-20-4  (2 unrouted)
5V  (4 unrouted)
5V-REG  (3 unrouted)
5V_BOTTOM  (1 unrouted)
12VREG  (3 unrouted)
!BOOT!  (1 unrouted)
!RESET!  (1 unrouted)
+3V3  (69 unrouted)
+5V  (36 unrouted)
+12V  (3 unrouted)
+24V  (39 unrouted)
+24V1  (1 unrouted)
+24V2  (1 unrouted)
ACT_LED  (1 unrouted)
ADC0  (2 unrouted)
ADC1  (2 unrouted)
ADC2  (2 unrouted)
ADC3  (2 unrouted)
ADDR  (3 unrouted)
ALERT  (3 unrouted)
CC1  (1 unrouted)
CC2  (1 unrouted)
COIL-1  (2 unrouted)
DS18B20  (3 unrouted)
FORCE2  (3 unrouted)
FORCE+  (3 unrouted)
FORCE-  (3 unrouted)
GND  (218 unrouted)
GND-ISO  (5 unrouted)
GND_BOTTOM  (1 unrouted)
I2C_!INT!  (1 unrouted)
I2C_SCL  (2 unrouted)
I2C_SDA  (2 unrouted)
INTERRUPT_OPTOIN  (1 unrouted)
IO0/BOOTMODE  (2 unrouted)
IO3/TWI_SDA  (12 unrouted)
IO4/TWI_SCK  (12 unrouted)
IO5/SDCS  (3 unrouted)
IO35/MOSI  (11 unrouted)
IO36/SCLK  (12 unrouted)
IO37/MISO  (11 unrouted)
IO48/STATUSLED  (1 unrouted)
LINK_LED  (1 unrouted)
MOSFET1  (1 unrouted)
MOSFET1-GND  (4 unrouted)
MOSFET2  (1 unrouted)
MOSFET2-GND  (4 unrouted)
MOSFET3  (1 unrouted)
MOSFET3-GND  (4 unrouted)
MOSFET4  (1 unrouted)
MOSFET4-GND  (4 unrouted)
MOSFET5  (1 unrouted)
MOSFET5-GND  (4 unrouted)
MOSFET6  (1 unrouted)
MOSFET6-GND  (4 unrouted)
MOSFET7  (1 unrouted)
MOSFET7-GND  (4 unrouted)
MOSFET8  (1 unrouted)
MOSFET8-GND  (4 unrouted)
N$1  (3 unrouted)
N$2  (3 unrouted)
N$3  (3 unrouted)
N$4  (2 unrouted)
N$5  (2 unrouted)
N$7  (1 unrouted)
N$8  (2 unrouted)
N$11  (1 unrouted)
N$13  (3 unrouted)
N$14  (2 unrouted)
N$15  (1 unrouted)
N$16  (2 unrouted)
N$17  (3 unrouted)
N$18  (3 unrouted)
N$19  (3 unrouted)
N$20  (3 unrouted)
N$21  (1 unrouted)
N$22  (1 unrouted)
N$23  (1 unrouted)
N$24  (1 unrouted)
N$25  (2 unrouted)
N$26  (2 unrouted)
N$27  (2 unrouted)
N$28  (2 unrouted)
N$29  (1 unrouted)
N$30  (1 unrouted)
N$31  (2 unrouted)
N$32  (2 unrouted)
N$33  (3 unrouted)
N$34  (3 unrouted)
N$35  (3 unrouted)
N$36  (3 unrouted)
N$37  (2 unrouted)
N$38  (1 unrouted)
N$39  (3 unrouted)
N$40  (3 unrouted)
N$41  (1 unrouted)
N$42  (2 unrouted)
N$43  (2 unrouted)
N$44  (2 unrouted)
N$45  (1 unrouted)
N$46  (1 unrouted)
N$47  (1 unrouted)
N$48  (1 unrouted)
N$49  (1 unrouted)
N$50  (2 unrouted)
N$51  (2 unrouted)
N$52  (2 unrouted)
N$53  (2 unrouted)
N$54  (1 unrouted)
N$55  (1 unrouted)
N$56  (1 unrouted)
N$57  (1 unrouted)
N$58  (1 unrouted)
N$59  (1 unrouted)
N$60  (1 unrouted)
N$61  (1 unrouted)
N$62  (1 unrouted)
N$63  (1 unrouted)
N$64  (1 unrouted)
N$65  (1 unrouted)
N$66  (1 unrouted)
N$67  (2 unrouted)
N$68  (2 unrouted)
N$69  (1 unrouted)
N$70  (2 unrouted)
N$71  (2 unrouted)
N$72  (1 unrouted)
N$73  (1 unrouted)
N$74  (1 unrouted)
N$75  (3 unrouted)
N$76  (1 unrouted)
N$77  (1 unrouted)
N$78  (2 unrouted)
N$79  (1 unrouted)
N$80  (2 unrouted)
N$81  (3 unrouted)
N$82  (3 unrouted)
N$83  (3 unrouted)
N$84  (2 unrouted)
N$85  (2 unrouted)
N$86  (2 unrouted)
N$87  (1 unrouted)
N$88  (1 unrouted)
N$89  (1 unrouted)
N$90  (2 unrouted)
N$91  (1 unrouted)
N$92  (1 unrouted)
N$93  (1 unrouted)
N$94  (1 unrouted)
N$95  (1 unrouted)
N$96  (1 unrouted)
N$97  (1 unrouted)
N$98  (1 unrouted)
N$99  (1 unrouted)
N$100  (2 unrouted)
N$101  (2 unrouted)
N$102  (2 unrouted)
N$103  (2 unrouted)
N$104  (2 unrouted)
N$105  (2 unrouted)
N$106  (2 unrouted)
N$107  (2 unrouted)
N$164  (2 unrouted)
OPTO1  (4 unrouted)
OPTO2  (4 unrouted)
OPTO3  (4 unrouted)
OPTO4  (4 unrouted)
OPTO5  (4 unrouted)
OPTO6  (4 unrouted)
OPTO7  (4 unrouted)
OPTO8  (4 unrouted)
PMODE0  (1 unrouted)
PMODE1  (1 unrouted)
PMODE2  (1 unrouted)
PT100CS  (1 unrouted)
RCT  (3 unrouted)
RD+  (2 unrouted)
RD-  (2 unrouted)
RELAY1  (1 unrouted)
RELAY-C  (3 unrouted)
RELAY-NC  (2 unrouted)
RELAY-NO  (2 unrouted)
RESET  (3 unrouted)
RESET_IN  (1 unrouted)
RTDIN+  (4 unrouted)
RTDIN-  (4 unrouted)
RXD/IO44  (4 unrouted)
RXN  (1 unrouted)
RXN1  (2 unrouted)
RXP  (1 unrouted)
RXP1  (2 unrouted)
SPAREIO1  (1 unrouted)
SPAREIO2  (1 unrouted)
SPAREIO3  (1 unrouted)
SPAREIO4  (1 unrouted)
SPI_CIPO  (1 unrouted)
SPI_COPI  (1 unrouted)
SPI_PROCESSOR_SCK  (1 unrouted)
SPI_PROCESSOR_SDI  (1 unrouted)
SPI_PROCESSOR_SDO  (1 unrouted)
SPI_SCK  (1 unrouted)
TCT  (2 unrouted)
TD+  (3 unrouted)
TD-  (3 unrouted)
TERMOCPL_CS  (2 unrouted)
TXD/IO43  (4 unrouted)
TXN  (1 unrouted)
TXP  (1 unrouted)
USB_D_N  (2 unrouted)
USB_D_P  (1 unrouted)
USB_INT  (1 unrouted)
USBMS_CS  (2 unrouted)
VBUS  (4 unrouted)
VCC  (3 unrouted)
  pour Bottom (no thermals): 107.42,10.19 107.41,10.17 107.41,8.44 107.15,8.44 107.15,10.17 107.14,10.19 107.12,10.21 107.1,10.22 106.9,10.22 106.9,11.18 108.07,11.18 108.07,10.22 107.96,10.22 107.94,10.21 107.92,10.19 107.91,10.17 107.91,8.44 107.66,8.44 107.66,10.17 107.65,10.19 107.63,10.21 107.61,10.22 107.46,10.22 107.43,10.21
  pour Bottom (no thermals): 145.77,10.19 145.76,10.17 145.76,8.44 145.51,8.44 145.51,10.17 145.5,10.19 145.48,10.21 145.46,10.22 145.4,10.22 145.4,11.26 146.62,11.26 146.62,10.22 146.32,10.22 146.3,10.21 146.28,10.19 146.27,10.17 146.27,8.44 146.01,8.44 146.01,10.17 146,10.19 145.99,10.21 145.96,10.22 145.81,10.22 145.79,10.21
VCC_IN  (1 unrouted)
VCCA  (16 unrouted)

## Text on the board
Measures: Units in Inches